# EAGLE design phone-finder (EAGLE 6.5.0)
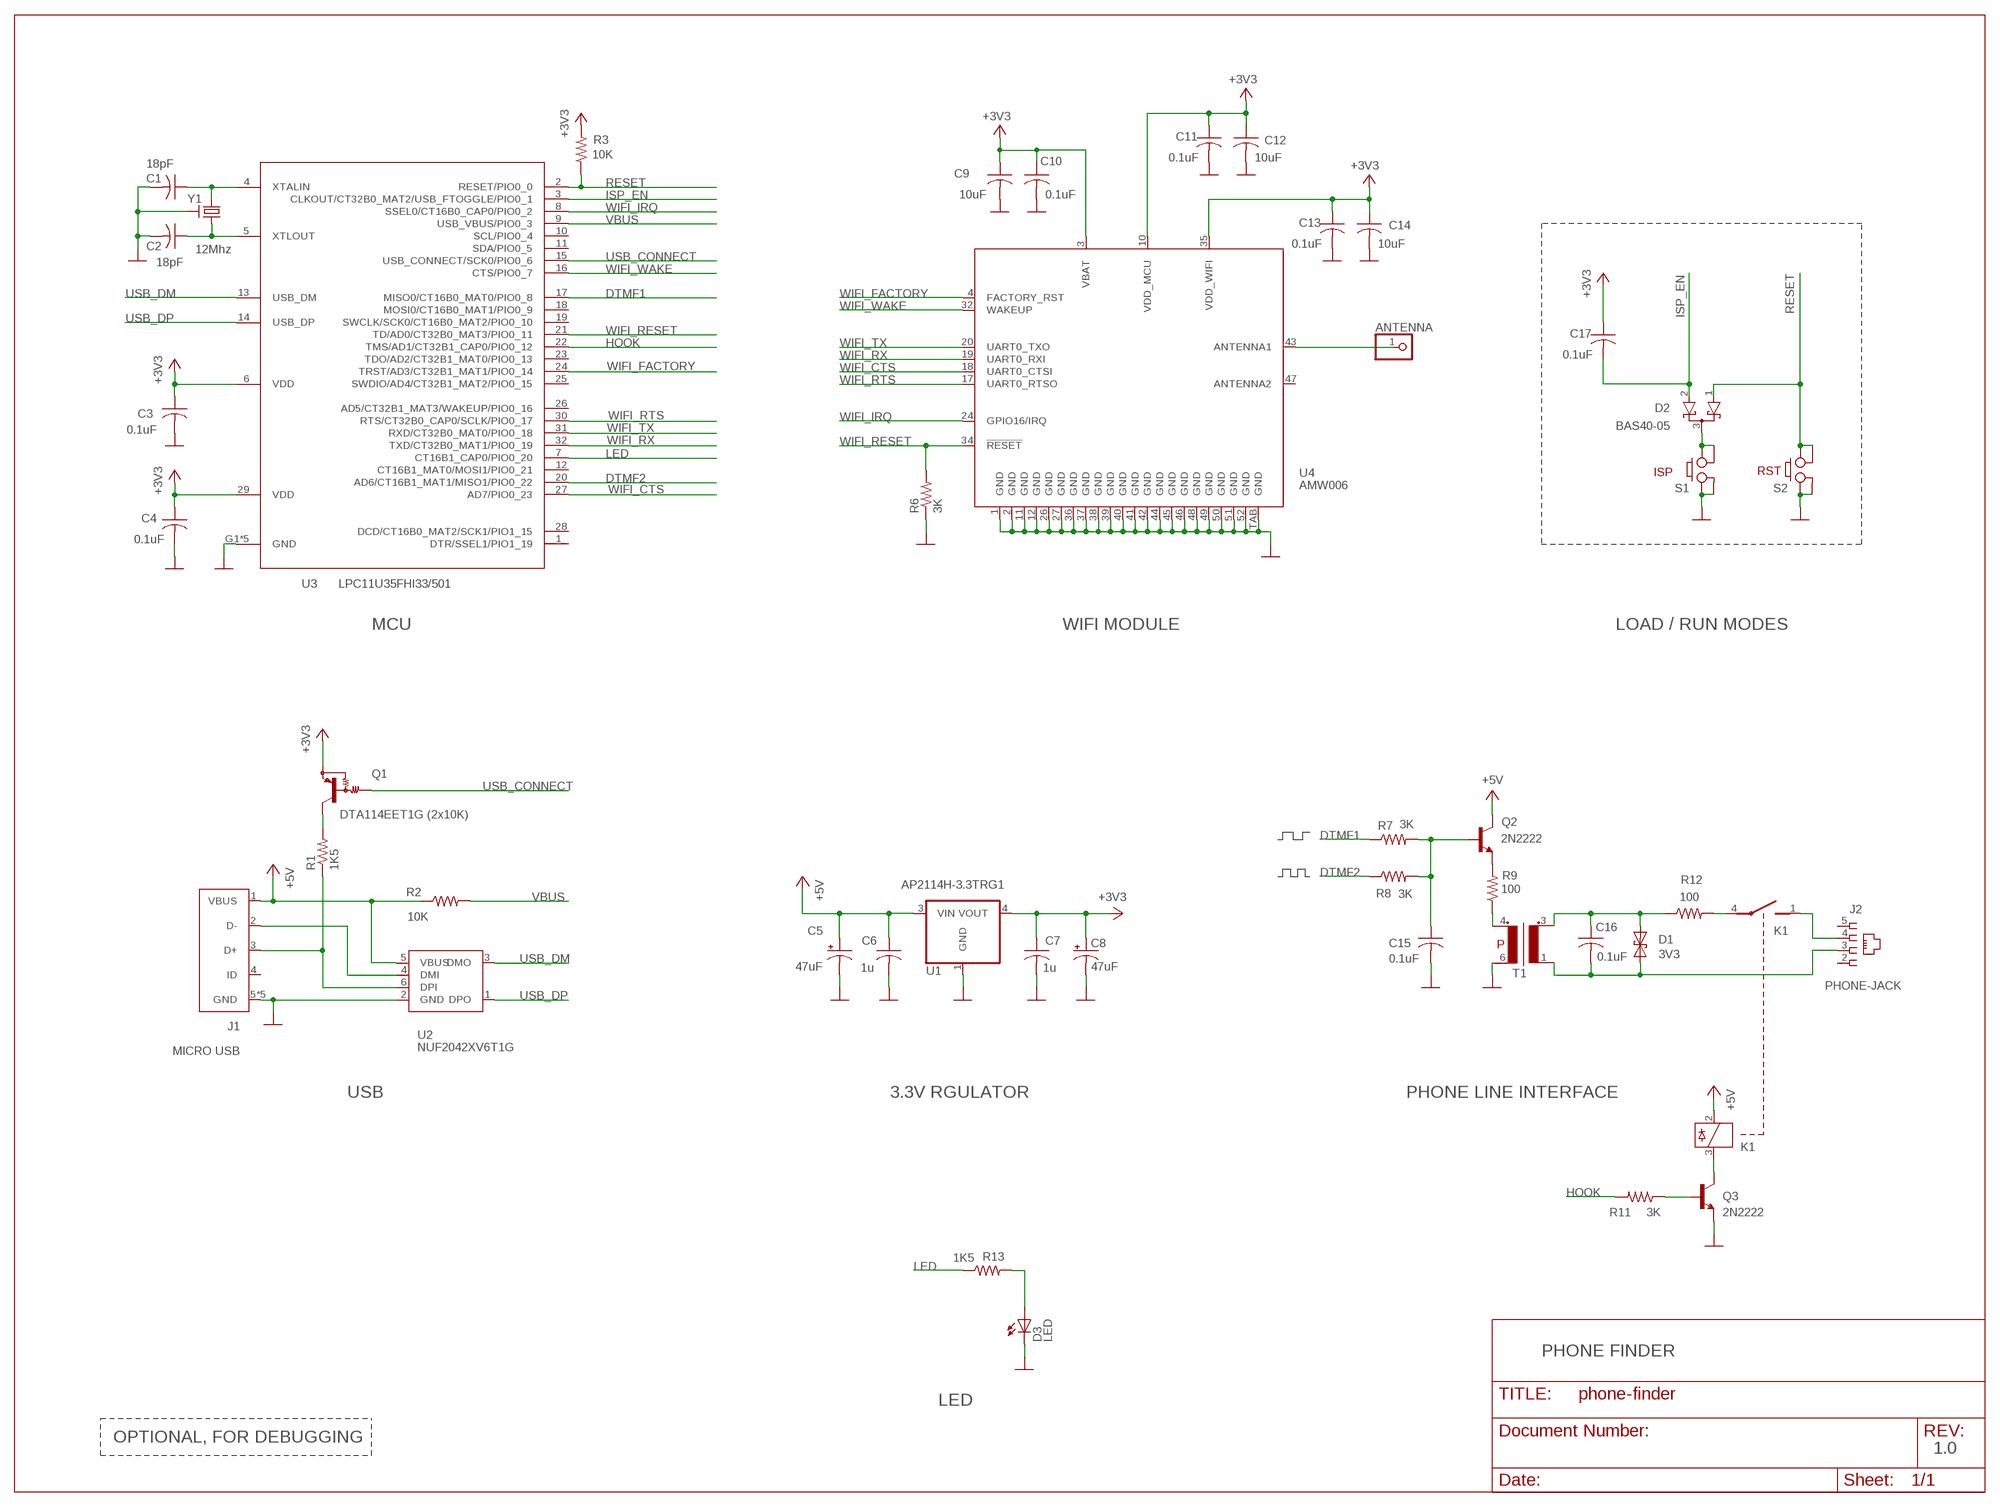
[diagram p0: schematic, sheet 1]

## Parts
ANTENNA  PINHD-1X1  [PINHD-1X1]
C1  18pF  CC0402K  [C0402K]
C2  18pF  CC0402K  [C0402K]
C3  0.1uF  CC0402K  [C0402K]
C4  0.1uF  CC0402K  [C0402K]
C5  47uF  C-POLUD-6,3X5,8  [UD-6,3X5,8_NICHICON]
C6  1u  CC0603K  [C0603K]
C7  1u  CC0603K  [C0603K]
C8  47uF  C-POLUD-6,3X5,8  [UD-6,3X5,8_NICHICON]
C9  10uF  CC0805K  [C0805K]
C10  0.1uF  CC0402K  [C0402K]
C11  0.1uF  CC0402K  [C0402K]
C12  10uF  CC0805K  [C0805K]
C13  0.1uF  CC0402K  [C0402K]
C14  10uF  CC0805K  [C0805K]
C15  0.1uF  CC0402K  [C0402K]
C16  0.1uF  CC0402K  [C0402K]
C17  0.1uF  CC0402K  [C0402K]
D1  3V3  DUAL-ZENER  [DZ-0402]
D2  BAS40-05  [SOT23]
D3  LED  [LED]
J1  MICRO USB  USB-CONN  [USB-MICRO]
J2  PHONE-JACK  [PHONE-JACK]
K1  RELAY  [RELAY]
Q1  DTA114EET1G (2x10K)  PNP-BIASED  [SC75-BEC]
Q2  2N2222  NPN  [SOT23]
Q3  2N2222  NPN  [SOT23]
R1  1K5  RR0402  [R0402]
R2  10K  RR0402  [R0402]
R3  10K  RR0402  [R0402]
R6  3K  RR0402  [R0402]
R7  3K  RR0402  [R0402]
R8  3K  RR0402  [R0402]
R9  100  RR0805  [R0805]
R11  3K  RR0402  [R0402]
R12  100  RR0805  [R0805]
R13  1K5  RR0402  [R0402]
S1  PUSH-BUTTON  [PUSH_BUTTON]
S2  PUSH-BUTTON  [PUSH_BUTTON]
T1  TRANSFORMER  [TRANSFORMER]
U1  AP2114H-3.3TRG1  LDOSOT223  [SOT223]
U2  NUF2042XV6T1G  USB-ESD  [SOT-563]
U3  LPC11U35FHI33/501  LPC11U35FHN33/501  [HVQFN33-5MM]
U4  AMW006  WIFI-MODULESMT  [WIFI_MODULE]
Y1  12Mhz  CRYSTALCTS406  [CRYSTAL]

## Nets
+3V3: C3.1 C4.1 C7.1 C8.+ C9.1 C10.1 C11.1 C12.1 C13.1 C14.1 C17.1 Q1.E R3.2 U1.4(VOUT) U3.6(VDD) U3.29(VDD) U4.3(VBAT) U4.10(VDD_MCU) U4.35(VDD_WIFI)
+5V: C5.+ C6.1 J1.1(VBUS) K1.2(1:COIL-POS) Q2.3(C) R2.1 U1.3(VIN) U2.5(VBUS)
DTMF1: R7.1 U3.17(MISO0/CT16B0_MAT0/PIO0_8)
DTMF2: R8.1 U3.20(AD6/CT16B1_MAT1/MISO1/PIO0_22)
GND: C1.2 C2.2 C3.2 C4.2 C5.- C6.2 C7.2 C8.- C9.2 C10.2 C11.2 C12.2 C13.2 C14.2 C15.2 D3.K(C) J1.5(GND) J1.G1(GND) J1.G2(GND) J1.G3(GND) J1.G4(GND) Q3.2(E) R6.1 S1.A1 S1.A1P(A1) S1.A2 S1.A2P(A2) S2.A1 S2.A1P(A1) S2.A2 S2.A2P(A2) T1.6(P2) U1.1(GND) U2.2(GND) U3.G1(GND) U3.G2(GND) U3.G3(GND) U3.G4(GND) U3.TAB(GND) U4.1(GND) U4.2(GND) U4.11(GND) U4.12(GND) U4.26(GND) U4.27(GND) U4.36(GND) U4.37(GND) U4.38(GND) U4.39(GND) U4.40(GND) U4.41(GND) U4.42(GND) U4.44(GND) U4.45(GND) U4.46(GND) U4.48(GND) U4.49(GND) U4.50(GND) U4.51(GND) U4.52(GND) U4.TAB(GND) Y1.2(GND) Y1.4(GND)
HOOK: R11.2 U3.22(TMS/AD1/CT32B1_CAP0/PIO0_12)
ISP_EN: C17.2 D2.2(A2) U3.3(CLKOUT/CT32B0_MAT2/USB_FTOGGLE/PIO0_1)
LED: R13.1 U3.7(CT16B1_CAP0/PIO0_20)
N$1: C1.1 U3.4(XTALIN) Y1.3
N$2: ANTENNA.1 U4.43(ANTENNA1)
N$3: C2.1 U3.5(XTLOUT) Y1.1
N$4: K1.3(1:COIL-NEG) Q3.3(C)
N$5: Q1.C R1.2
N$6: J1.3(D+) R1.1 U2.6(DPI)
N$7: Q3.1(B) R11.1
N$8: Q2.2(E) R9.2
N$9: C16.1 D1.2 R12.1 T1.3(S1)
N$10: C16.2 D1.1 J2.3 T1.1(S2)
N$11: J2.4 K1.1(2:S1)
N$12 [critical]: J1.2(D-) U2.4(DMI)
N$14: D3.A R13.2
N$15: K1.4(2:S2) R12.2
N$16: D2.3(C) S1.B1 S1.B1P(B1) S1.B2 S1.B2P(B2)
N$17: R9.1 T1.4(P1)
N$23: C15.1 Q2.1(B) R7.2 R8.2
RESET: D2.1(A1) R3.1 S2.B1 S2.B1P(B1) S2.B2 S2.B2P(B2) U3.2(RESET/PIO0_0)
USB_CONNECT: Q1.B U3.15(USB_CONNECT/SCK0/PIO0_6)
USB_DM [critical]: U2.3(DMO) U3.13(USB_DM)
USB_DP [critical]: U2.1(DPO) U3.14(USB_DP)
VBUS: R2.2 U3.9(USB_VBUS/PIO0_3)
WIFI_CTS: U3.27(AD7/PIO0_23) U4.18(UART0_CTSI)
WIFI_FACTORY: U3.24(TRST/AD3/CT32B1_MAT1/PIO0_14) U4.4(FACTORY_RST)
WIFI_IRQ: U3.8(SSEL0/CT16B0_CAP0/PIO0_2) U4.24(GPIO16/IRQ)
WIFI_RESET: R6.2 U3.21(TD/AD0/CT32B0_MAT3/PIO0_11) U4.34(!RESET)
WIFI_RTS: U3.30(RTS/CT32B0_CAP0/SCLK/PIO0_17) U4.17(UART0_RTSO)
WIFI_RX: U3.32(TXD/CT32B0_MAT1/PIO0_19) U4.19(UART0_RXI)
WIFI_TX: U3.31(RXD/CT32B0_MAT0/PIO0_18) U4.20(UART0_TXO)
WIFI_WAKE: U3.16(CTS/PIO0_7) U4.32(WAKEUP)
Unconnected: J1.4(ID) J2.2 J2.5 U3.1(DTR/SSEL1/PIO1_19) U3.10(SCL/PIO0_4) U3.11(SDA/PIO0_5) U3.12(CT16B1_MAT0/MOSI1/PIO0_21) U3.18(MOSI0/CT16B0_MAT1/PIO0_9) U3.19(SWCLK/SCK0/CT16B0_MAT2/PIO0_10) U3.23(TDO/AD2/CT32B1_MAT0/PIO0_13) U3.25(SWDIO/AD4/CT32B1_MAT2/PIO0_15) U3.26(AD5/CT32B1_MAT3/WAKEUP/PIO0_16) U3.28(DCD/CT16B0_MAT2/SCK1/PIO1_15) U4.47(ANTENNA2)

## Notes on the sheet
- ISP | RST
- MCU | WIFI MODULE | LOAD / RUN MODES
- USB | 3.3V RGULATOR | PHONE LINE INTERFACE
- PHONE FINDER
- LED
- OPTIONAL, FOR DEBUGGING
- 1.0

## Library data of the parts
ANTENNA = phone-finder:PINHD-1X1: PIN HEADER
C1-C4 C6 C7 C9-C17 = phone-finder:C
C5 C8 = phone-finder:C-POL: POLARIZED CAPACITOR, American symbol
D1 = phone-finder:DUAL-ZENER: DIODE uni and bidirectional supressor diode
D2 = phone-finder:BAS40-05
D3 = phone-finder:LED
J1 = phone-finder:USB-CONN
J2 = phone-finder:PHONE-JACK; OC_FARNELL: unknown; OC_NEWARK: unknown
K1 = phone-finder:RELAY: RELAY reed, 1 x norm. open with polarity; OC_FARNELL: unknown; OC_NEWARK: unknown
Q1 = phone-finder:PNP-BIASED: DTA114EET1G (Digikey DTA114EET1GOSCT-ND)
Q2 Q3 = phone-finder:NPN: NPN Transistor
R1-R3 R6-R9 R11-R13 = phone-finder:R: RESISTOR, American symbol
S1 S2 = phone-finder:PUSH-BUTTON: CKN10502CT-ND
T1 = phone-finder:TRANSFORMER
U1 = phone-finder:LDO
U2 = phone-finder:USB-ESD
U3 = phone-finder:LPC11U35FHN33/501
U4 = phone-finder:WIFI-MODULE
Y1 = phone-finder:CRYSTAL: CRYSTAL; OC_FARNELL: unknown; OC_NEWARK: unknown

## Net classes
1 power: width 0.254 mm

## Board
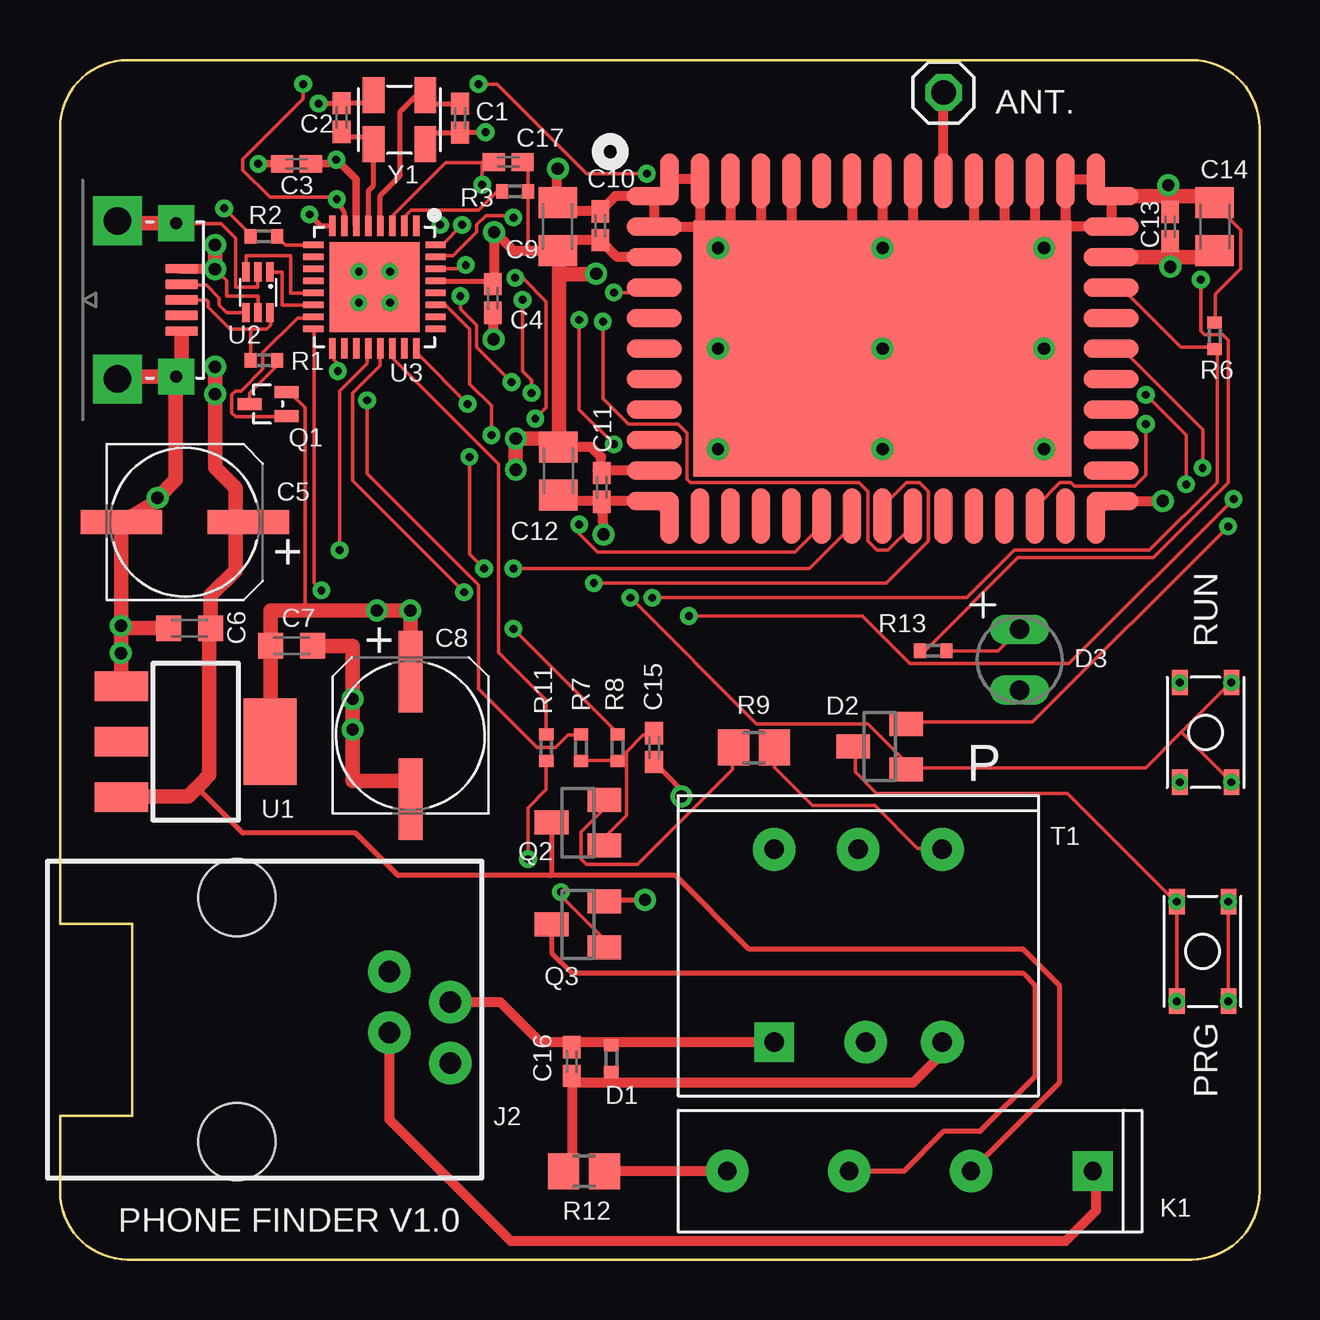
[diagram p1: board, top side]
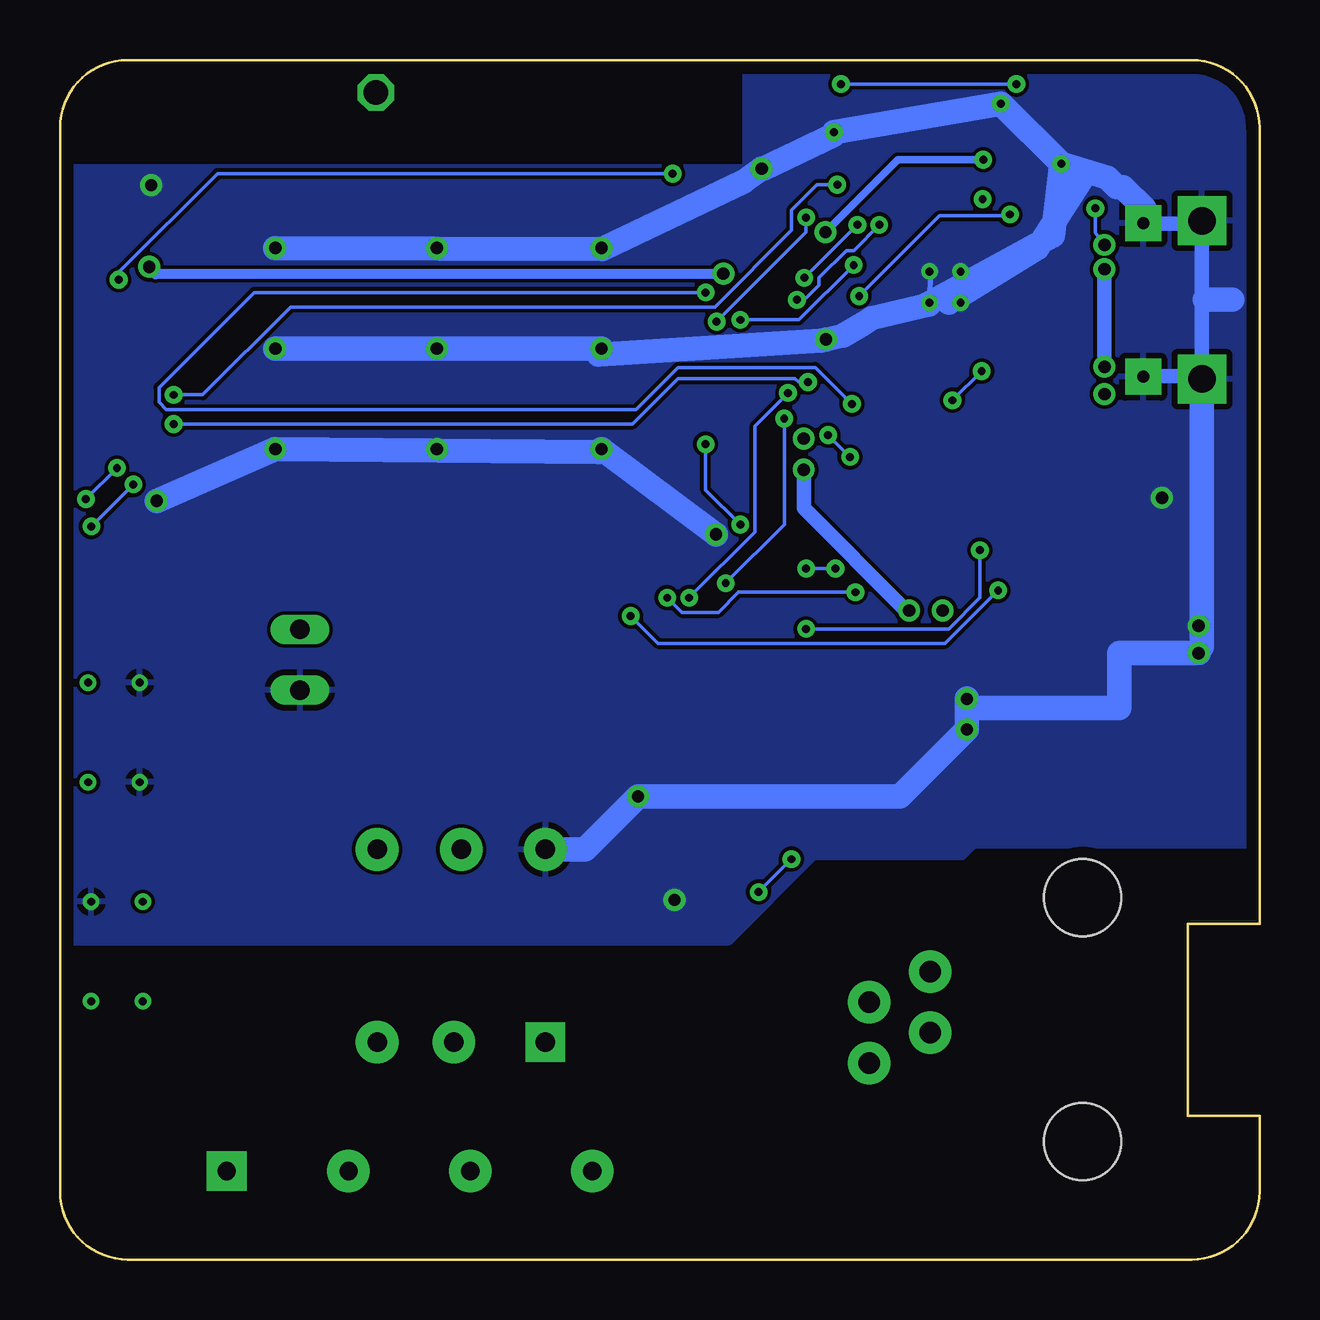
[diagram p2: board, bottom side, seen from below]

Size 50 x 50 mm. Coordinates in mm from the lower left corner, seen from the top.
Outline: 50,2.83 50,47.17 arc90 47.17,50 2.83,50 arc90 0,47.17 0,14 3,14 3,6 0,6 0,2.83 arc90 2.83,0 47.17,0 arc90 50,2.83
Copper layers (1*16): Top 0.035mm / dielectric 1.5mm / Bottom 0.035mm
Design rules "default *": minimum track width 6mil, minimum drill 13mil, track to track 6mil, track to pad 6mil, pad to pad 6mil, via to via 6mil, smd to smd 0mil, copper to edge 20mil, drill to drill 8mil, minimum pad ring 7mil, minimum via ring 8mil, stop-mask expansion 4mil, vias tented up to drill 20mil, thermal gap 10mil
tRestrict: area 21.7,46.2 to 52.8,51.4; area -1,35.1 to 1.1,44.5; 7 lines
bRestrict: area 21.6,45.7 to 52.7,50.9; 7 lines

### Footprints (pad centres in the part's own frame; a part is rotated, then mirrored left to right if it is on the bottom)
PINHD-1X1 = drill 1.016 octagon: 1 0,0
C0402K = smd 0.925 x 0.74: 1 -0.6,0; 2 0.6,0
UD-6,3X5,8_NICHICON = smd 3.4 x 1: + 2.65,0; - -2.65,0
C0603K = smd 1.05 x 1.08: 1 -0.875,0; 2 0.875,0
C0805K = smd 1.3 x 1.6: 1 -1,0; 2 1,0
DZ-0402 = smd 0.5 x 0.6: 1 -0.55,0; 2 0.55,0
SOT23 = smd 1 x 1.4: 1 -0.95,-1.1; 2 0.95,-1.1; 3 0,1.1
LED = drill 0.813 long: A -1.27,0; K 1.27,0
USB-MICRO = smd 0.4 x 1.35: 1 -1.3,2.675; 2 -0.65,2.675; 3 0,2.675; 4 0.65,2.675; 5 1.3,2.675 | drill 1.143 pad 2.032 square: G1 -3.3,0; G2 3.3,0 | drill 0.508 pad 1.5 square: G3 -3.2,2.45; G4 3.2,2.45
PHONE-JACK = drill 0.9 pad 1.778: 2 -2,6.36; 3 -0.73,8.9; 4 0.54,6.36; 5 1.81,8.9 | hole 3.2: -5.08,0; 5.08,0
RELAY = drill 0.762 pad 1.651 square: 1 -7.62,0 | drill 0.762 pad 1.778: 2 -2.54,0; 3 2.54,0; 4 7.62,0
SC75-BEC = smd 0.5 x 1: B -0.5,-0.771; C 0,0.771; E 0.5,-0.771
R0402 = smd 0.5 x 0.6: 1 -0.55,0; 2 0.55,0
R0805 = smd 1.3 x 1.5: 1 -0.85,0; 2 0.85,0
PUSH_BUTTON = smd 1.05 x 0.65: A1 -2.075,1.075; A2 2.075,1.075; B1 -2.075,-1.075; B2 2.075,-1.075 | drill 0.33 pad 0.61: A1P -2.075,1.075; A2P 2.075,1.075; B1P -2.075,-1.075; B2P 2.075,-1.075
TRANSFORMER = drill 0.813 pad 1.651 square: 1 4.013,-3.505 | drill 0.813 pad 1.778: 2 4.013,0.305; 3 4.013,3.505; 4 -4.013,3.505; 5 -4.013,0; 6 -4.013,-3.505
SOT223 = smd 1.219 x 2.235: 1 -2.311,-3.099; 2 0,-3.099; 3 2.311,-3.099 | smd 3.6 x 2.2: 4 0,3.099
SOT-563 = smd 0.3 x 0.8: 1 -0.5,-0.85; 2 0,-0.85; 3 0.5,-0.85; 4 0.5,0.85; 5 0,0.85; 6 -0.5,0.85
HVQFN33-5MM = smd 0.85 x 0.27: 1 -2.55,1.75; 2 -2.55,1.25; 3 -2.55,0.75; 4 -2.55,0.25; 5 -2.55,-0.25; 6 -2.55,-0.75; 7 -2.55,-1.25; 8 -2.55,-1.75; 17 2.55,-1.75; 18 2.55,-1.25; 19 2.55,-0.75; 20 2.55,-0.25; 21 2.55,0.25; 22 2.55,0.75; 23 2.55,1.25; 24 2.55,1.75 | smd 0.27 x 0.85: 9 -1.75,-2.55; 10 -1.25,-2.55; 11 -0.75,-2.55; 12 -0.25,-2.55; 13 0.25,-2.55; 14 0.75,-2.55; 15 1.25,-2.55; 16 1.75,-2.55; 25 1.75,2.55; 26 1.25,2.55; 27 0.75,2.55; 28 0.25,2.55; 29 -0.25,2.55; 30 -0.75,2.55; 31 -1.25,2.55; 32 -1.75,2.55 | drill 0.33 pad 0.6: G1 -0.65,0.65; G2 -0.65,-0.65; G3 0.65,-0.65; G4 0.65,0.65 | smd 3.75 x 3.75: TAB 0,0
WIFI_MODULE = smd 2.159 x 0.762: 1 0.572,13.97; 11 0.572,1.27; 27 19.748,1.27; 37 19.748,13.97 | smd 2.286 x 0.762: 2 0.635,12.7; 3 0.635,11.43; 4 0.635,10.16; 5 0.635,8.89; 6 0.635,7.62; 7 0.635,6.35; 8 0.635,5.08; 9 0.635,3.81; 10 0.635,2.54; 28 19.685,2.54; 29 19.685,3.81; 30 19.685,5.08; 31 19.685,6.35; 32 19.685,7.62; 33 19.685,8.89; 34 19.685,10.16; 35 19.685,11.43; 36 19.685,12.7 | smd 0.762 x 2.159: 12 1.27,0.572; 26 19.05,0.572; 38 19.05,14.668; 52 1.27,14.668 | smd 0.762 x 2.286: 13 2.54,0.635; 14 3.81,0.635; 15 5.08,0.635; 16 6.35,0.635; 17 7.62,0.635; 18 8.89,0.635; 19 10.16,0.635; 20 11.43,0.635; 21 12.7,0.635; 22 13.97,0.635; 23 15.24,0.635; 24 16.51,0.635; 25 17.78,0.635; 39 17.78,14.605; 40 16.51,14.605; 41 15.24,14.605; 42 13.97,14.605; 43 12.7,14.605; 44 11.43,14.605; 45 10.16,14.605; 46 8.89,14.605; 47 7.62,14.605; 48 6.35,14.605; 49 5.08,14.605; 50 3.81,14.605; 51 2.54,14.605 | smd 15.748 x 10.668: TAB 10.16,7.62
CRYSTAL = smd 0.9 x 1.5: 1 -1.075,-1.025; 2 1.075,-1.025; 3 1.075,1.025; 4 -1.075,1.025

### Placement (x,y rotation side)
ANTENNA  36.83,48.64 0 top
C1  16.68,47.57 270 top
C2  11.74,47.6 90 top
C3  9.86,45.67 180 top
C4  18.04,40.06 270 top
C5  5.21,30.73 0 top
C6  5.4,26.31 180 top
C7  9.66,25.58 0 top
C8  14.61,21.84 90 top
C9  20.74,43.06 90 top
C10  22.52,43.09 90 top
C11  22.58,32.18 270 top
C12  20.78,32.87 270 top
C13  46.27,43.05 90 top
C14  48.13,43.05 90 top
C15  24.77,21.34 270 top
C16  21.34,8.26 90 top
C17  18.69,45.74 180 top
D1  22.99,8.38 270 top
D2  34.17,21.38 90 top
D3  40,25 270 top
J1  2.4,40 270 top
J2  7.37,10 270 top
K1  35.43,3.68 180 top
Q1  8.67,35.66 90 top
Q2  21.59,18.21 90 top
Q3  21.59,13.97 90 top
R1  8.49,37.48 0 top
R2  8.49,42.65 0 top
R3  18.97,44.52 0 top
R6  48.13,38.51 270 top
R7  21.72,21.34 270 top
R8  23.24,21.34 270 top
R9  28.93,21.34 180 top
R11  20.27,21.34 90 top
R12  21.84,3.68 0 top
R13  36.4,25.37 0 top
S1  47.62,12.84 270 top
S2  47.75,21.97 90 top
T1  33.27,13.08 270 top
U1  5.66,21.59 270 top
U2  8.25,40.32 180 top
U3  13.11,40.53 270 top
U4  24.13,30.35 0 top
Y1  14.15,47.51 0 top

### Tracks (layer width: path | path; a pad name or v marks a point on that pad's centre or on a via)
+3V3  (via drill 0.33, 0.51)
  Top 0.152: C17.1 19.36,45.72 19.51,45.57 19.51,44.58 R3.2 19.51,44.5 19.51,42.06 | U3.6 12.34,43.05 12.35,43.13 | 22.4,41.15 v22.35,41.1 22.33,41.07 | 20.8,34.37 20.57,34.37 C12.1 | C9.1 20.73,42.06 20.8,41.83 | 10.21,27.05 10.21,35.51 9.6,36.12 9.45,36.12 Q1.E | C11.1 22.48,32.92 22.55,33.06
  Top 0.203: U3.29 17.92,40.78 C4.1
  Top 0.305: 12.35,43.13 12.35,45.03 11.54,45.85 v11.52,45.85 11.44,45.92 11.19,45.67 C3.1 | 47.73,42.45 47.73,42.03 47.85,41.91 46.28,41.91
  Top 0.406: 48.21,41.78 C14.1 47.73,42.45 | C9.1 21.05,42.49 C10.1 23.23,41.78 U4.3 | U4.10 22.39,32.89 C11.1 | U1.4 8.78,21.59 | 22.55,33.06 22.55,33.45 22.14,33.87 C12.1 20.57,33.83 | 20.74,41.94 C9.1 | v46.28,41.38 v46.27,41.38 | C4.1 18.09,40.83 v18.09,42.82 18.25,42.67 18.29,42.67 18.9,42.06 19.51,42.06 C9.1
  Top 0.61: C8.+ v14.61,27.05 v13.21,27.05 10.21,27.05 8.78,27.05 C7.1 8.78,21.59 | v19,32.92 v19,34.21 20.36,34.21 C12.1 | 20.8,41.83 20.8,41.22 | 20.8,41.22 20.8,34.37 20.8,33.83 | 22.33,41.07 20.95,41.07 20.8,41.22 | U4.35 47.86,41.78 C14.1 | v46.28,41.38 46.28,41.91 C13.1
  Bottom 0.152: 46.33,41.38 v46.28,41.38 | 22.4,41.07 v22.35,41.1
  Bottom 0.203: v14.61,27.05 14.73,27.05
  Bottom 0.305: v11.52,45.85 15.07,45.85 v18.09,42.82
  Bottom 0.406: 22.4,41.07 46.02,41.07 46.33,41.38
  Bottom 0.61: 14.73,27.05 19,31.32 v19,32.92
+5V  (via drill 0.33, 0.51)
  Top 0.152: U2.5 8.25,40.16 6.94,40.16 6.94,40.79 v6.46,41.27 6.44,41.3 | 8,42.66 R2.1 7.94,42.71 v6.84,43.81 v6.84,43.8
  Top 0.203: K1.2 41.66,7.37 41.66,11.43 40.13,12.95 28.7,12.95 25.65,16 20.45,16 | 20.45,16 14.1,16 12.32,17.78 7.62,17.78 5.84,19.56 | Q2.3 20.49,16.05 20.45,16
  Top 0.305: 5.84,19.81 5.84,19.56
  Top 0.406: J1.1 6.44,41.3
  Top 0.61: v6.46,37.21 v6.46,36.07 6.46,33.01 7.32,32.16 7.32,30.71 | 7.62,30.73 C5.+ 7.83,30.71 7.32,30.71 | U1.3 2.59,19.3 5.33,19.3 5.84,19.81 6.22,20.19 6.22,26.31 C6.1 6.28,27.69 7.32,28.73 7.32,30.71 | v6.46,41.27 v6.46,42.29
  Bottom 0.152: v6.84,43.81 6.84,42.8 v6.46,42.29
  Bottom 0.61: v6.46,37.21 v6.46,41.27
DTMF1  (via drill 0.33)
  Top 0.152: v12.8,35.81 12.8,32.77 17.45,28.12 17.45,23.77 19.89,21.34 20.65,21.34 21.18,21.87 21.72,21.87 R7.1 | v11.58,37.03 11.58,37.34 11.43,37.49 11.43,37.95 U3.17
  Bottom 0.152: v11.58,37.03 v12.8,35.81
DTMF2  (via drill 0.33)
  Top 0.152: v18.9,26.29 23.24,21.95 R8.1 | v11.66,29.57 11.66,36.2 12.8,37.34 12.8,37.95 U3.20
  Bottom 0.152: v18.9,26.29 12.95,26.29 11.66,27.58 v11.66,29.57
GND  (via drill 0.33, 0.51)
  Top 0.152: 4.99,43.05 J1.G3 4.87,43.18 6.71,43.18 7.33,42.57 7.33,40.54 8.24,40.54 U2.2 | 48.69,10.82 S1.A2 48.69,10.9 48.69,14.86 S1.A1P | R6.1 48.16,39.09 48.16,40.23 49.23,41.3 49.23,42.9 48.31,43.81 C14.2 | 20.8,45.49 v20.75,45.47 | J1.5 5.11,38.71 5.06,38.48 | U3.TAB 13.18,40.46 13.72,39.93 U3.G4
  Top 0.203: 11.57,48.54 C2.2 | C2.2 11.73,48.18 v10.78,48.18 | Y1.4 13.07,48.2 C2.2 | Y1.2 15.22,46.97 C1.2 16.68,46.99 v17.74,46.99 | Q3.2 22.76,14.99 v24.38,14.99 | C15.2 25.91,19.54 v25.91,19.3 | U4.11 U4.12 | U4.27 U4.26 | 43.18,44.96 U4.38 | U4.37 43.81,44.26 43.81,44.2 | 24.77,44.32 U4.1
  Top 0.254: 47.73,43.65 47.73,44.2 46.2,44.2
  Top 0.305: C3.2 v8.26,45.67
  Top 0.406: 35.56,38.48 U4.TAB | 33.02,38.48 33.02,38.61 26.67,38.61 | 33.02,38.48 33.78,38.48 33.91,38.35 | 33.91,38.35 U4.TAB | 27.94,38.48 33.02,38.48 | U4.TAB 38.1,38.48 39.37,38.48 | 40.64,38.48 U4.TAB | 41.91,38.48 34.79,38.01 | 34.79,38.01 U4.TAB | U4.50 27.94,41.15 | 27.94,41.15 27.94,37.97 U4.TAB | U4.49 29.21,38.35 33.91,38.35 | U4.48 30.48,38.01 34.79,38.01 | U4.46 33.02,37.97 U4.TAB | U4.45 34.29,38.61 | 34.29,38.61 U4.TAB | U4.TAB 35.56,37.97 U4.44 35.56,38.1 34.54,38.1 | U4.42 38.1,38.61 34.29,38.61 | U4.41 39.37,37.97 U4.TAB | U4.40 40.64,37.97 U4.TAB | 34.04,37.08 41.91,37.08 U4.39 41.91,45.02 U4.38 | 34.29,43.05 U4.36 43.81,44.2 43.81,44.32 43.18,44.32 43.18,44.96 | 34.29,43.05 U4.2 24.77,44.32 | 34.29,43.05 U4.TAB | 27.94,41.15 26.67,41.15 U4.51 26.67,45.02 U4.52 | 48.21,44.32 C14.2 47.73,43.65 | U4.1 23.16,44.32 C10.2 21.24,43.69 C9.2 | U4.11 22.39,31.62 | 22.39,31.62 C11.2 v22.66,30.23 | 20.57,31.75 20.32,32 C12.2 20.78,31.62 22.39,31.62 | U4.27 v45.97,31.62 | 14.61,19.94 C8.- | C4.2 18.03,39.42 v18.07,38.35 | 20.73,44.2 20.73,45.49 20.8,45.49
  Top 0.61: J1.G2 2.5,36.8 J1.G4 5.06,37.02 5.06,38.48 | J1.G3 2.5,43.2 J1.G1 | 2.56,26.31 C5.- 4.06,31.61 v4.06,31.75 4.83,32.51 4.83,36.7 | 2.56,26.31 U1.1 | C6.2 2.56,26.31 | C7.2 12.19,25.58 v12.19,23.37 12.19,23.32 12.19,19.94 14.61,19.94 | U4.37 47.86,44.32 C14.2 | v46.2,44.78 46.2,44.2 46.2,43.72 C13.2
  Bottom 0.203: U3.G4 13.7,41.15 13.78,39.8
  Bottom 0.406: 12.19,22.99 v12.19,23.37
  Bottom 0.61: J1.G1 2.4,43.18 | 2.4,43.18 2.4,36.83 | 2.4,36.83 J1.G2 | 4.81,36.83 2.54,36.83 2.4,36.83 | 4.94,43.18 4.81,43.18 2.4,43.18
  Bottom 1.016: v22.66,30.23 v27.43,33.78 | v45.97,31.62 v41.02,33.78 27.56,33.66 | 13.88,39.8 8.62,42.67 v8.26,45.67 | 13.78,39.8 16.16,39.24 16.52,39.01 17.36,38.51 v18.07,38.35 | v8.26,45.67 6.33,45.09 5.95,44.7 5.7,44.7 4.81,43.81 4.81,43.18 | v17.74,46.99 v10.78,48.18 v8.26,45.67 | 17.76,46.86 20.68,45.47 | v20.75,45.47 21.51,44.93 27.36,42.14 | 18.27,38.3 27.56,37.72 | 27.41,42.11 v41.02,42.16 | v27.43,37.97 v41.02,37.97 | v2.54,25.27 5.84,25.27 5.84,22.99 12.19,22.99 | 12.19,23.39 v12.19,22.1 14.99,19.3 v25.91,19.3 28.12,17.09 T1.6 | 12.94,39.88 9.26,42.16 7.48,44.96 | 2.54,36.83 2.41,36.83 2.41,25.53 | 2.29,40.01 1.14,40.01
  other vias: 27.43,42.16 34.29,37.97 34.29,42.16 34.29,33.78 2.54,26.42
  pour Bottom: 50.04,13.21 22.1,13.21 18.54,16.76 0,16.76 0,50 50,50
HOOK
  Top 0.152: R11.2 20.27,23.32 18.29,25.3 18.29,33.15 13.87,37.57 13.87,37.95 U3.22
ISP_EN  (via drill 0.33)
  Top 0.152: 17.6,45.72 18.06,45.72 C17.2 | 17.6,45.72 16.08,45.72 13.87,43.51 13.87,43.13 U3.3 | v48.69,30.56 40.54,22.4 35.28,22.4 D2.2 | v46.94,32.31 46.94,34.37 v45.26,36.04 | 17.6,45.72 v17.6,44.81
  Bottom 0.152: v46.94,32.31 v48.69,30.56 | v45.26,36.04 44.04,36.04 40.39,39.7 22.71,39.7 19.51,42.9 19.51,43.74 18.44,44.81 v17.6,44.81
LED  (via drill 0.33)
  Top 0.152: R13.1 36.04,25.38 39.93,29.26 45.57,29.26 48.69,32.38 48.69,38.33 48.46,38.56 47.7,38.56 47.55,38.71 v47.55,40.84 | v24.46,45.26 21.95,45.26 18.21,49 v17.45,49 | v10.13,49 10.13,48.39 7.62,45.87 7.62,45.41 8.76,44.27 11.51,44.27 v11.54,44.2
  Top 0.203: U3.7 11.86,43.63 v11.54,44.2
  Bottom 0.152: v47.55,40.84 47.55,41.15 43.43,45.26 v24.46,45.26 | v10.13,49 v17.45,49
N$1
  Top 0.203: U3.4 13.32,43.12 13.34,43.15 13.34,44.35 14.18,45.19 14.18,47.85 14.87,48.54 Y1.3 15.2,48.17 C1.1
N$2
  Top 0.203: U4.43 36.83,45.21
  Top 0.406: 36.83,45.21 ANTENNA.1
N$3
  Top 0.203: 13.19,46.23 12.86,46.32 Y1.1 | 13.32,46.24 Y1.1 | U3.5 12.86,44.55 13.07,44.76 Y1.1 | Y1.1 13.07,46.79 11.74,46.79 C2.1
N$4
  Top 0.203: Q3.3 20.49,12.78 21.34,11.94 40.13,11.94 40.64,11.43 40.64,7.62 38.35,5.33 36.83,5.33 35.18,3.68 K1.3
N$5
  Top 0.152: R1.2 9.04,37.25 7.9,36.11 Q1.C
N$6
  Top 0.152: J1.3 6.11,40 6.18,39.93 6.18,39.7 7.1,38.79 7.93,38.79 | 7.93,38.79 8.62,38.79 8.77,38.94 8.77,39.45 U2.6 | 7.93,38.79 7.94,38.78 R1.1
N$7  (via drill 0.33)
  Top 0.152: R11.1 20.27,19.58 19.51,18.82 v19.51,16.69 | v20.88,15.32 20.88,15.16 22.63,13.41 22.63,13.03 Q3.1
  Bottom 0.152: v20.88,15.32 v19.51,16.69
N$8
  Top 0.152: Q2.2 22.63,19.13 22.63,18.75 21.72,17.83 21.72,16.69 21.95,16.46 24.08,16.46 28.04,20.42 28.04,21.34 R9.2
N$9
  Top 0.152: T1.3 36.73,9.07 36.73,8.99 36.58,8.87
  Top 0.406: 21.08,3.77 R12.1 21.34,3.68 21.34,7.37 | 36.58,8.87 36.58,8.38 35.56,7.37 22.86,7.37 | 22.86,7.37 21.34,7.37 | 21.34,7.37 C16.1 | D1.2 22.86,7.83 22.86,7.37
N$10
  Top 0.406: 21.55,9.07 22.86,9.07 | 22.86,9.07 T1.1 | D1.1 22.86,9.06 22.86,9.07 | C16.2 21.55,9.07 | J2.3 18.35,10.73 20.02,9.07 21.55,9.07
N$11
  Top 0.406: K1.1 43.18,3.56 43.18,2.03 41.91,0.76 18.8,0.76 13.73,5.82 J2.4
N$12
  Top 0.152: J1.2 5.11,40.61 6.11,40.61 6.64,40.08 6.64,39.78 6.94,39.47 U2.4
N$14
  Top 0.152: R13.2 39.09,25.38 39.93,26.21 D3.A
N$15
  Top 0.406: K1.4 R12.2
N$16
  Top 0.152: 46.56,10.82 S1.B2P 46.56,10.9 46.56,14.86 S1.B1 | 46.56,14.94 S1.B1 | D2.3 33.07,21.34 33.07,21.03 33.15,20.95 33.15,20.32 34.04,19.43 41.99,19.43 46.48,14.94 S1.B1
N$17
  Top 0.152: T1.4 36.73,17.14 35.74,17.14 33.96,18.92 31.37,18.92 29.78,20.51 R9.1
N$23
  Top 0.152: 23.24,20.8 21.72,20.8 R7.2 | 23.24,20.8 23.58,21.14 | 23.58,21.14 24.31,21.87 24.77,21.87 C15.1 | 23.24,20.8 R8.2 | Q2.1 22.71,17.3 22.71,17.6 23.62,18.52 23.62,21.11 23.58,21.14
RESET  (via drill 0.33)
  Top 0.152: 15.85,43.74 14.63,43.74 14.4,43.51 14.4,43.13 U3.2 | 15.85,43.74 17.45,43.74 18.21,44.5 18.36,44.5 R3.1 | 48.84,19.89 S2.B1 48.77,19.96 46.75,21.98 | 48.84,24.08 S2.B2P 48.77,24 46.75,21.98 | 35.51,20.5 45.26,20.5 46.75,21.98 | 35.51,20.5 35.28,20.5 D2.1 35.51,20.5 | v15.85,43.13 15.85,43.74 | v19.28,40.01 19.28,37.03 19.66,36.65 v19.66,36.12 | v23.77,27.58 29.03,22.33 33.68,22.33 35.51,20.5
  Bottom 0.152: v15.85,43.13 16.92,42.06 17.22,42.06 18.36,40.92 18.36,40.62 18.97,40.01 v19.28,40.01 | v19.66,36.12 21.03,34.75 21.03,30.33 v23.77,27.58
USB_CONNECT
  Top 0.152: U3.15 10.52,39.24 9.91,39.24 8.46,37.8 8.46,37.11 7.54,36.2 7.32,36.2 7.16,36.04 7.16,35.28 7.32,35.13 9.37,35.13 Q1.B
USB_DM
  Top 0.152: 7.73,41.27 U2.3 7.75,41.83 9.61,41.83 9.61,40.28 U3.13
USB_DP
  Top 0.152: U3.14 9.26,39.78 9.26,41.17 U2.1
VBUS
  Top 0.152: U3.9 9.41,42.28 R2.2
WIFI_CTS  (via drill 0.33)
  Top 0.152: v17.98,34.37 17.98,35.59 17.07,36.5 17.07,38.79 16.08,39.78 15.7,39.78 U3.27 | v17.07,33.45 17.07,29.41 v17.68,28.8 | v18.9,28.8 31.24,28.8 32.99,30.56 32.99,30.94 U4.18
  Bottom 0.152: v17.07,33.45 v17.98,34.37 | v18.9,28.8 v17.68,28.8
WIFI_FACTORY  (via drill 0.33)
  Top 0.152: v16.99,35.66 14.86,37.8 14.86,37.95 U3.24 | v23.09,40.31 24.61,40.31 24.77,40.46 U4.4
  Bottom 0.152: v16.99,35.66 18.52,37.19 24.23,37.19 25.98,35.43 45.57,35.43 45.87,35.74 45.87,36.35 41.91,40.31 v23.09,40.31
WIFI_IRQ  (via drill 0.33)
  Top 0.152: v16.69,40.16 16.69,39.62 17.37,38.94 17.37,38.02 v18.82,36.58 | v45.26,34.82 45.26,32.69 44.81,32.23 42.29,32.23 42.14,32.38 41.68,32.38 40.69,31.39 40.69,31.01 U4.24
  Top 0.203: U3.8 10.88,43.08 v10.4,43.56
  Bottom 0.152: v16.69,40.16 13.34,43.51 10.44,43.51 v10.4,43.56 | v18.82,36.58 19.2,36.58 19.36,36.73 24.23,36.73 26.14,34.82 v45.26,34.82
  Bottom 0.203: v10.4,43.56 10.27,43.56
WIFI_RESET  (via drill 0.33)
  Top 0.152: U4.34 43.81,40.46 44.27,40.46 46.71,38.02 48.08,38.02 R6.2 48.16,37.95 48.23,37.87 48.23,32.38 45.41,29.57 39.78,29.57 37.8,27.58 v24.69,27.58 | v16.84,27.81 12.19,32.46 12.19,36.12 13.34,37.26 13.34,37.95 U3.21
  Bottom 0.152: v16.84,27.81 21.72,27.81 22.55,26.98 24.08,26.98 v24.69,27.58
WIFI_RTS  (via drill 0.33)
  Top 0.152: v16.92,41.45 16.76,41.3 15.7,41.3 U3.30 | v21.64,39.17 21.64,35.43 v23.09,33.98 | v21.64,30.63 21.64,30.25 22.4,29.49 30.63,29.49 31.7,30.56 31.7,30.94 U4.17
  Bottom 0.152: v16.92,41.45 19.2,39.17 v21.64,39.17 | v23.09,33.98 23.09,32.08 v21.64,30.63
WIFI_RX  (via drill 0.33)
  Top 0.152: v16.76,43.13 15.93,42.29 15.7,42.29 U3.32 | v18.97,40.92 19.28,40.92 20.27,39.93 20.27,35.51 v19.81,35.05 | v22.25,28.19 34.44,28.19 36.2,29.95 36.2,32 35.81,32.38 35.28,32.38 34.29,31.39 U4.19
  Bottom 0.152: v18.97,40.92 v16.76,43.13 | v19.81,35.05 19.81,30.63 v22.25,28.19
WIFI_TX  (via drill 0.33)
  Top 0.152: v18.9,43.43 18.82,43.51 17.75,43.51 17.37,43.13 17.37,42.82 16.38,41.83 15.7,41.83 U3.31 | v22.63,39.09 22.63,35.89 23.7,34.82 25.76,34.82 26.14,34.44 26.14,32.54 26.29,32.38 33.3,32.38 33.68,32 33.68,29.95 34.06,29.57 34.52,29.57 35.51,30.56 35.51,30.94 U4.20
  Bottom 0.152: v18.9,43.43 18.9,42.82 v22.63,39.09
WIFI_WAKE  (via drill 0.33)
  Top 0.152: v10.9,27.89 10.59,28.19 10.59,38.71 U3.16 | v26.21,26.82 33.45,26.82 35.43,24.84 42.06,24.84 v48.92,31.7 | v47.62,32.99 47.62,34.59 44.27,37.95 43.81,37.95 U4.32
  Bottom 0.152: v10.9,27.89 13.11,25.68 25.07,25.68 v26.21,26.82 | v47.62,32.99 v48.92,31.7

### Text on the board
tPlace: ANT. | + | RUN | + | P | PRG | PHONE FINDER V1.0